# Altium schematic sheet STM32.SchDoc
size D; SheetNumber: 8; SheetTotal: 8
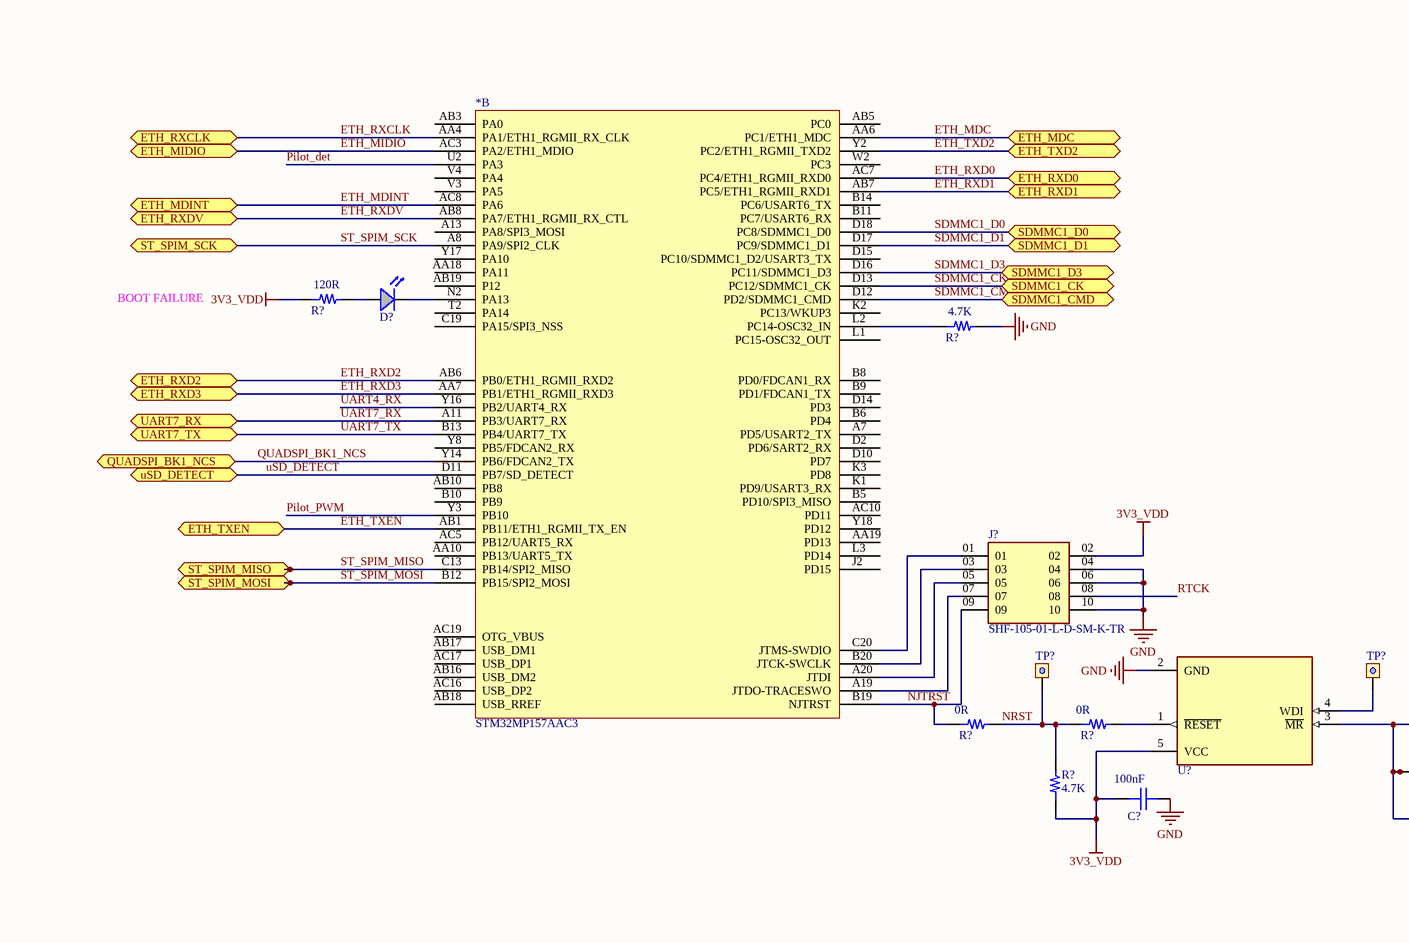
[diagram p0: STM32.SchDoc, top left]
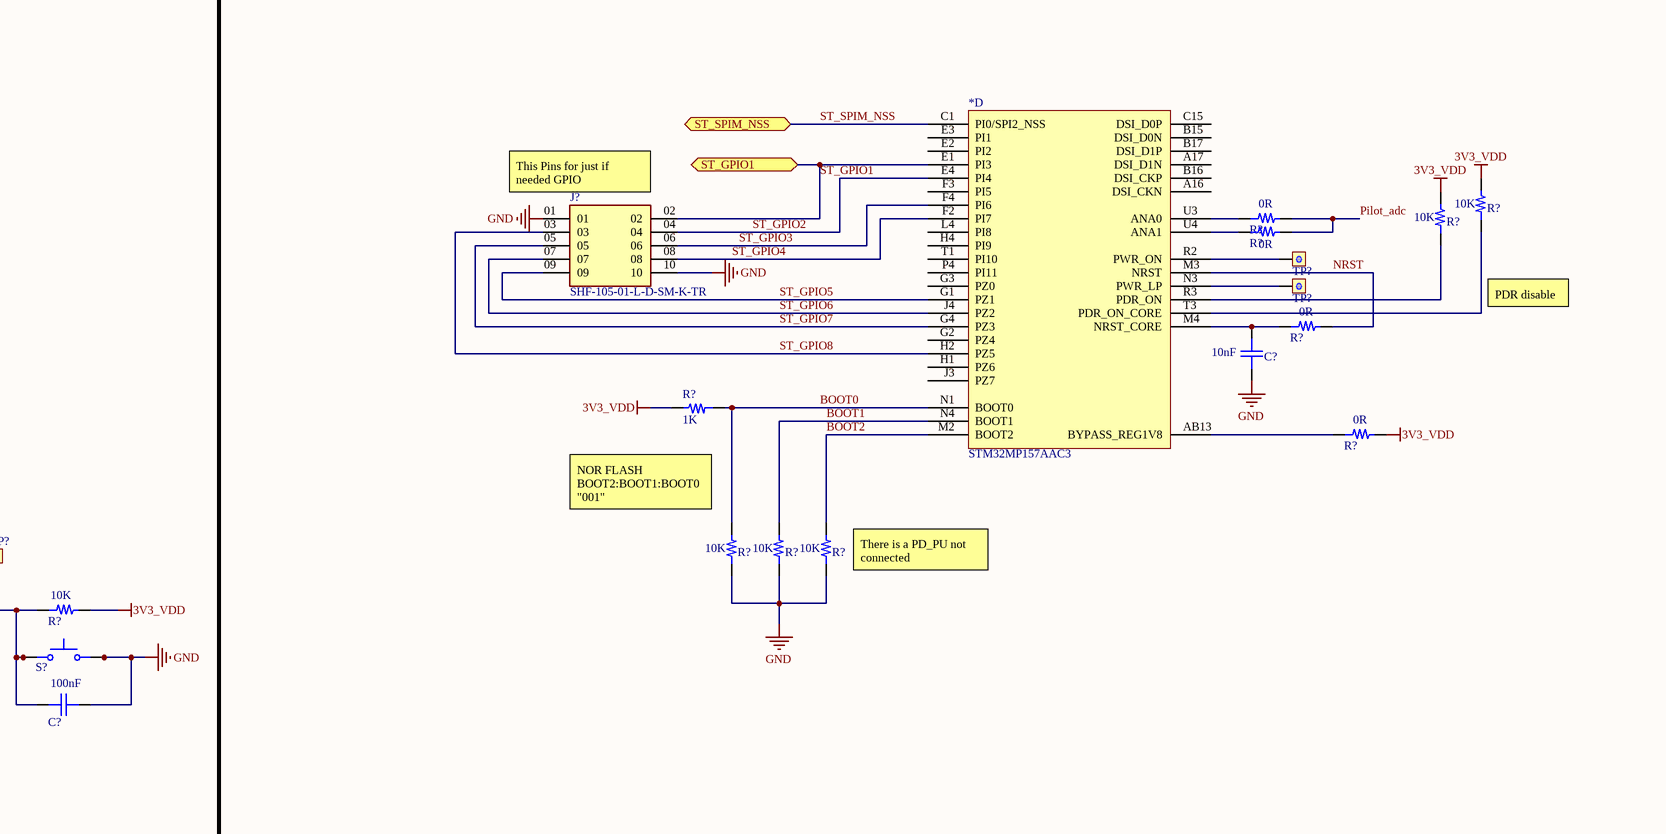
[diagram p1: STM32.SchDoc, top middle]
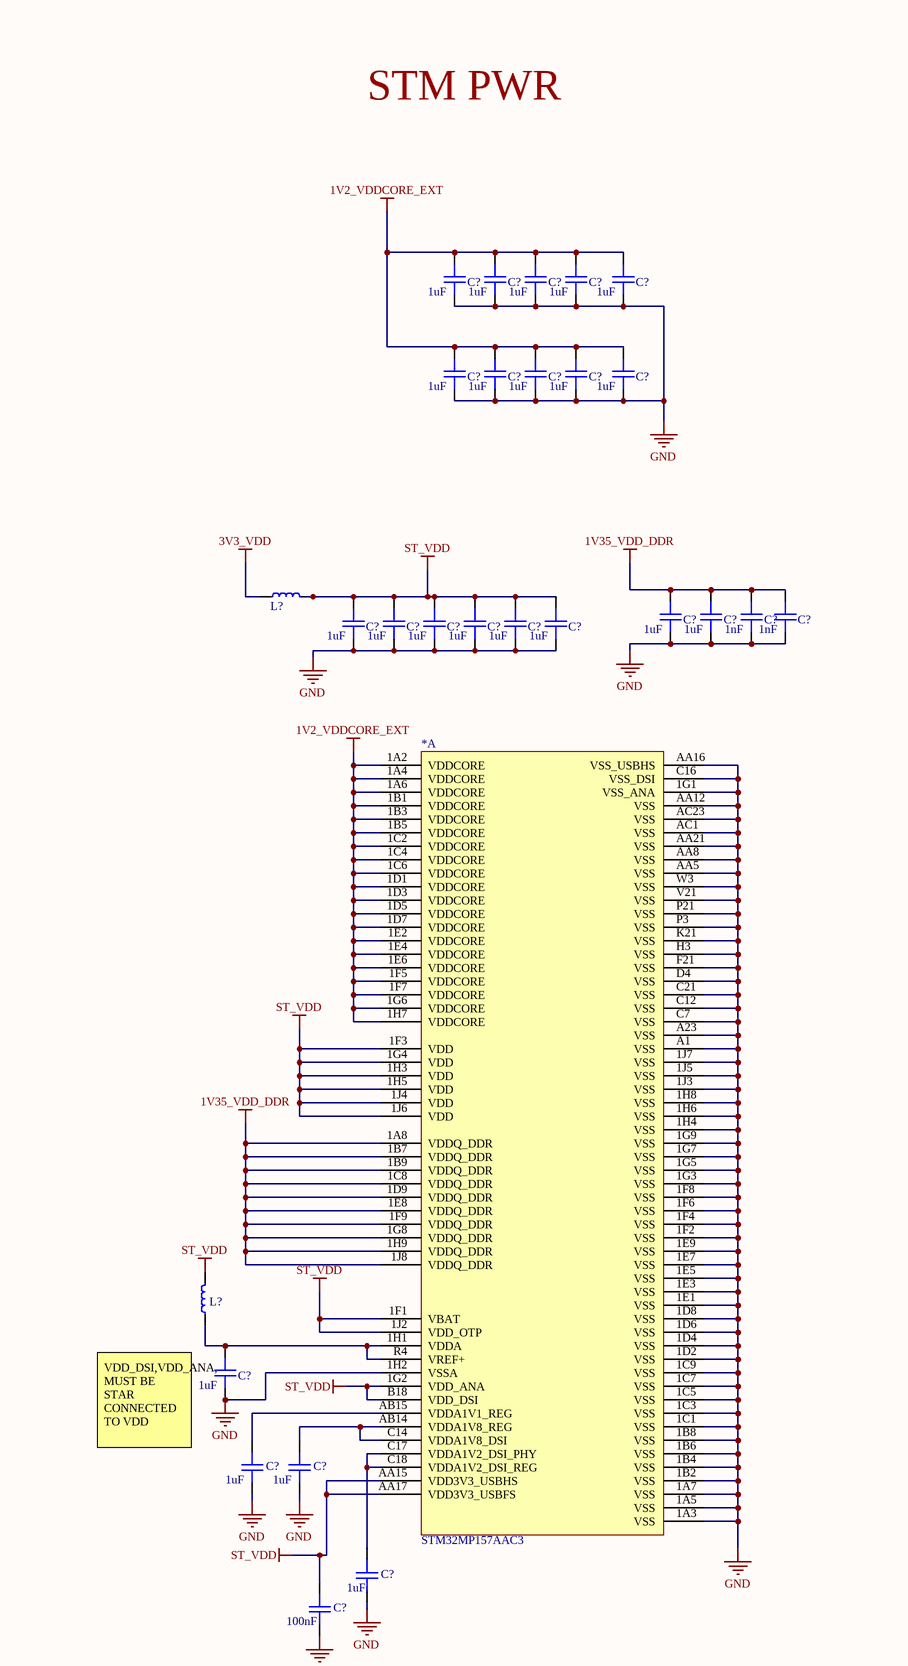
[diagram p2: STM32.SchDoc, top right]
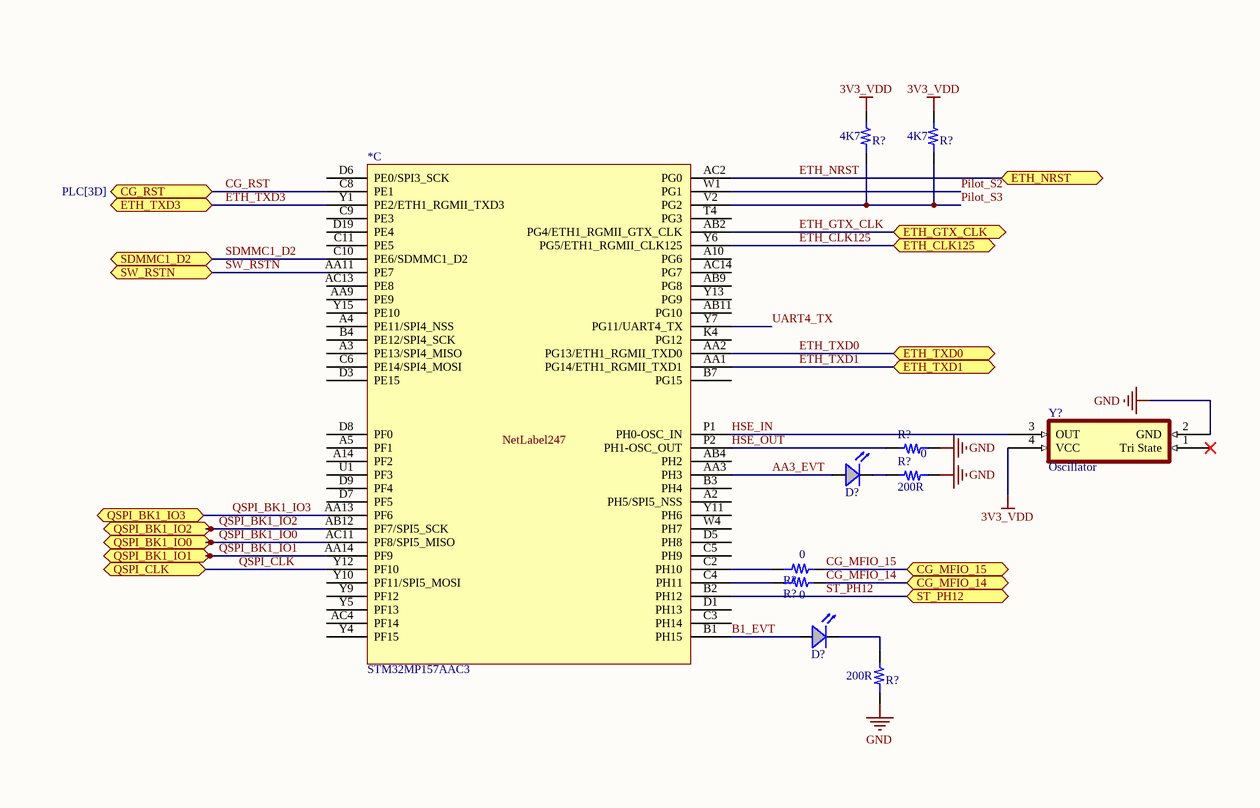
[diagram p3: STM32.SchDoc, bottom left]
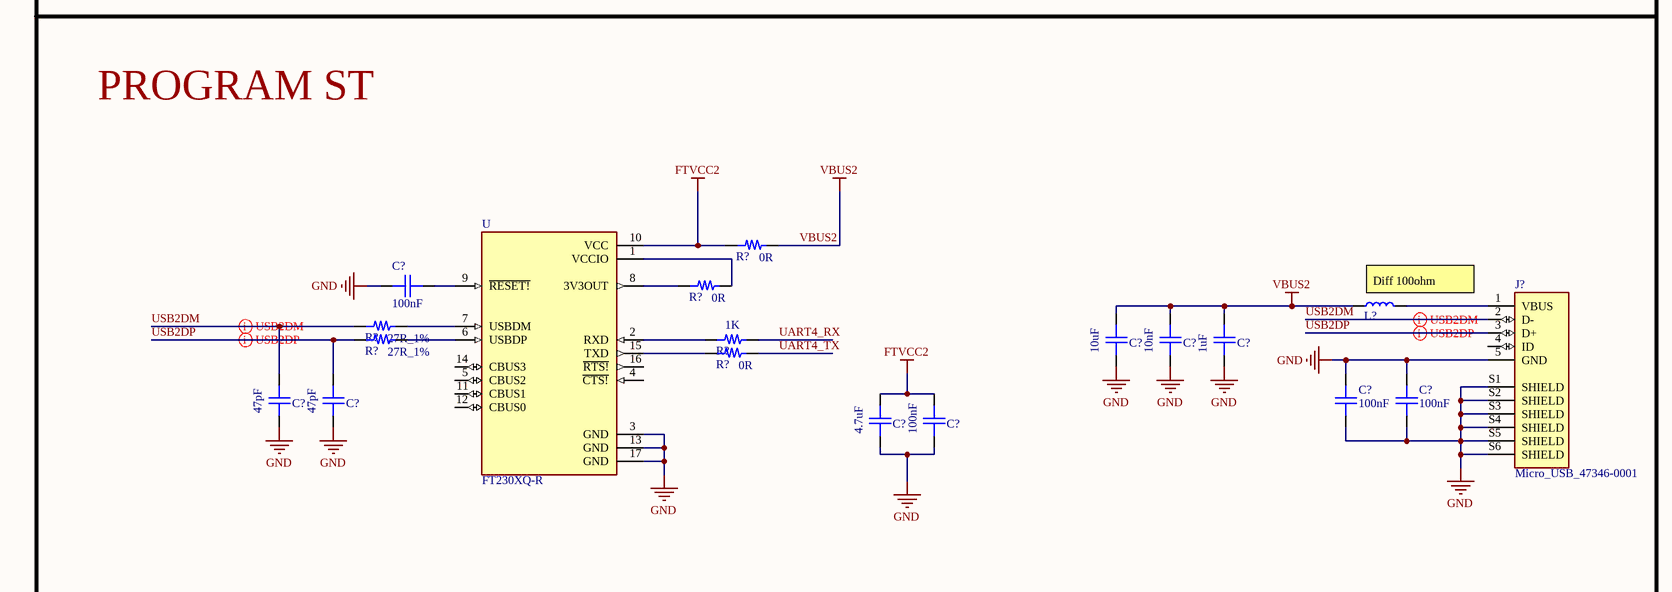
[diagram p4: STM32.SchDoc, bottom middle]
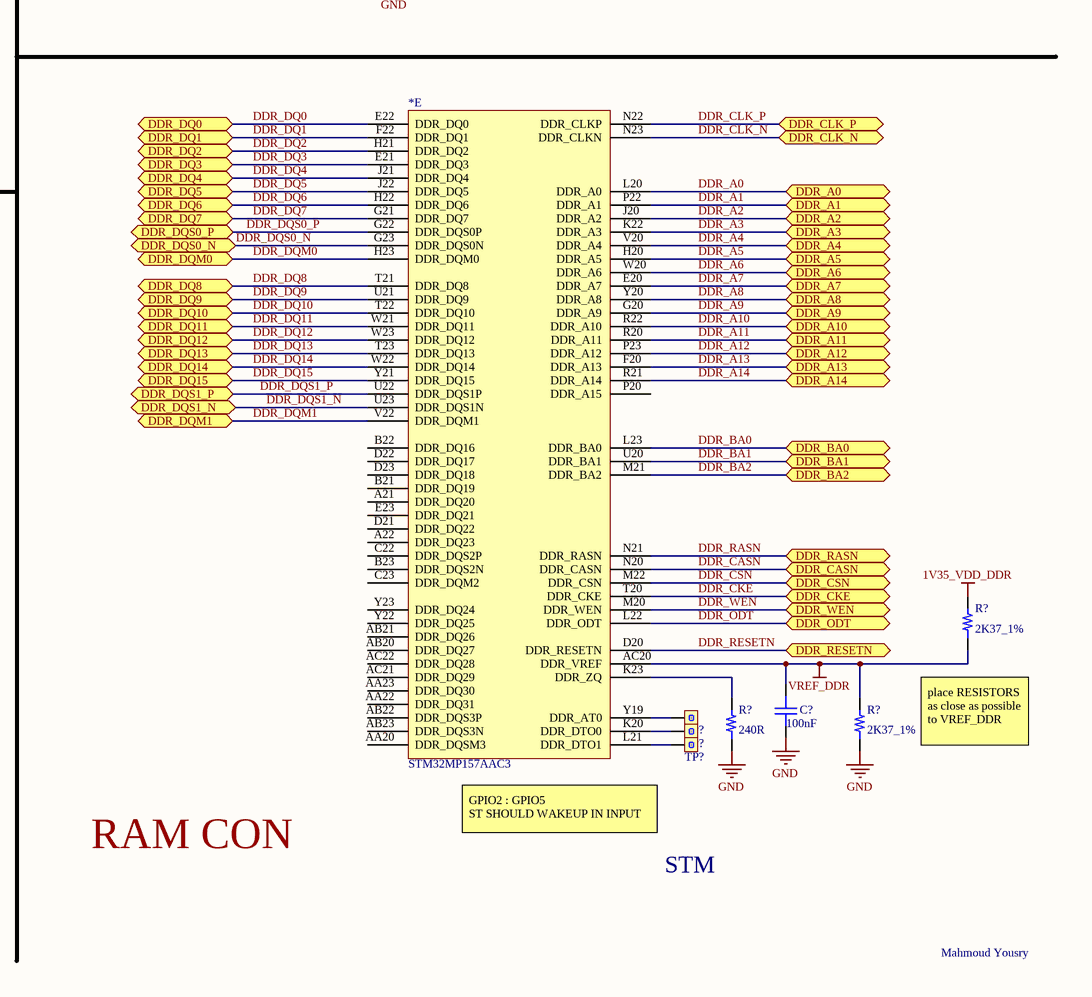
[diagram p5: STM32.SchDoc, bottom right]

## Parts
(Parts that share a designator on the sheet are numbered #1, #2 ... from top to bottom, then left to right.)
*#1  STM32MP157AAC3  (part B of 5)
*#2  STM32MP157AAC3  (part D of 5)
*#3  STM32MP157AAC3  (part A of 5)
*#4  STM32MP157AAC3  (part C of 5)
*#5  STM32MP157AAC3  (part E of 5)
C?#1  value 1uF  [C0402]  (hidden comment: Capacitor)
C?#2  value 1uF  [C0402]  (hidden comment: Capacitor)
C?#3  value 1uF  [C0402]  (hidden comment: Capacitor)
C?#4  value 1uF  [C0402]  (hidden comment: Capacitor)
C?#5  value 1uF  [C0402]  (hidden comment: Capacitor)
C?#6  value 1uF  [C0402]  (hidden comment: Capacitor)
C?#7  value 1uF  [C0402]  (hidden comment: Capacitor)
C?#8  value 1uF  [C0402]  (hidden comment: Capacitor)
C?#9  value 1uF  [C0402]  (hidden comment: Capacitor)
C?#10  value 1uF  [C0402]  (hidden comment: Capacitor)
C?#11  value 1uF  [C0402]  (hidden comment: Capacitor)
C?#12  value 1uF  [C0402]  (hidden comment: Capacitor)
C?#13  value 1nF  [C0402]  (hidden comment: Capacitor)
C?#14  value 1nF  [C0402]  (hidden comment: Capacitor)
C?#15  value 1uF  [C0402]  (hidden comment: Capacitor)
C?#16  value 1uF  [C0402]  (hidden comment: Capacitor)
C?#17  value 1uF  [C0402]  (hidden comment: Capacitor)
C?#18  value 1uF  [C0402]  (hidden comment: Capacitor)
C?#19  value 1uF  [C0402]  (hidden comment: Capacitor)
C?#20  value 1uF  [C0402]  (hidden comment: Capacitor)
C?#21  value 10nF  [C0402]  (hidden comment: Capacitor)
C?#22  value 100nF  [C0402]  (hidden comment: Capacitor)
C?#23  value 100nF  [C0402]  (hidden comment: Capacitor)
C?#24  value 1uF  [C0402]  (hidden comment: Capacitor)
C?#25  value 1uF  [C0402]  (hidden comment: Capacitor)
C?#26  value 1uF  [C0402]  (hidden comment: Capacitor)
C?#27  value 1uF  [C0402]  (hidden comment: Capacitor)
C?#28  value 100nF  [C0402]  (hidden comment: Capacitor)
C?#29  value 100nF  [C0402]  (hidden comment: Capacitor)
C?#30  value 10uF  [C0402]  (hidden comment: Capacitor)
C?#31  value 10nF  [C0402]  (hidden comment: Capacitor)
C?#32  value 1uF  [C0402]  (hidden comment: Capacitor)
C?#33  value 47pF  [C0402]  (hidden comment: Capacitor)
C?#34  value 47pF  [C0402]  (hidden comment: Capacitor)
C?#35  value 100nF  [C0402]  (hidden comment: Capacitor)
C?#36  value 100nF  [C0402]  (hidden comment: Capacitor)
C?#37  value 4.7uF  [C0402]  (hidden comment: Capacitor)
C?#38  value 100nF  [C0402]  (hidden comment: Capacitor)
C?#39  value 100nF  [C0402]  (hidden comment: Capacitor)
D?#1  LED  [LED_0603]  (value not drawn)
D?#2  LED  [LED_0603]  (value not drawn)
D?#3  LED  [LED_0603]  (value not drawn)
J?#1  SHF-105-01-L-D-SM-K-TR  [SAMTEC_SHF-105-01-L-D-SM-K-TR]
J?#2  SHF-105-01-L-D-SM-K-TR  [SAMTEC_SHF-105-01-L-D-SM-K-TR]
J?#3  Micro_USB_47346-0001  [Micro_USB_47346-0001]
L?#1  Inductor  [L_0603]  (value not drawn)
L?#2  Inductor  [L_0603]  (value not drawn)
L?#3  Inductor  [L_0603]  (value not drawn)
R?#1  value 120R  [R0402]  (hidden comment: Resistor)
R?#2  value 4.7K  [R0402]  (hidden comment: Resistor)
R?#3  value 0R  [R0402]  (hidden comment: Resistor)
R?#4  value 0R  [R0402]  (hidden comment: Resistor)
R?#5  value 10K  [R0402]  (hidden comment: Resistor)
R?#6  value 10K  [R0402]  (hidden comment: Resistor)
R?#7  value 0R  [R0402]  (hidden comment: Resistor)
R?#8  value 1K  [R0402]  (hidden comment: Resistor)
R?#9  value 0R  [R0402]  (hidden comment: Resistor)
R?#10  value 10K  [R0402]  (hidden comment: Resistor)
R?#11  value 10K  [R0402]  (hidden comment: Resistor)
R?#12  value 10K  [R0402]  (hidden comment: Resistor)
R?#13  value 0R  [R0402]  (hidden comment: Resistor)
R?#14  value 0R  [R0402]  (hidden comment: Resistor)
R?#15  value 10K  [R0402]  (hidden comment: Resistor)
R?#16  value 4.7K  [R0402]  (hidden comment: Resistor)
R?#17  value 4K7  [R0402]  (hidden comment: Resistor)
R?#18  value 4K7  [R0402]  (hidden comment: Resistor)
R?#19  value 0  [R0402]  (hidden comment: Resistor)
R?#20  value 200R  [R0402]  (hidden comment: Resistor)
R?#21  value 0  [R0402]  (hidden comment: Resistor)
R?#22  value 0R  [R0402]  (hidden comment: Resistor)
R?#23  value 0  [R0402]  (hidden comment: Resistor)
R?#24  value 0R  [R0402]  (hidden comment: Resistor)
R?#25  value 27R_1%  [R0402]  (hidden comment: Resistor)
R?#26  value 27R_1%  [R0402]  (hidden comment: Resistor)
R?#27  value 1K  [R0402]  (hidden comment: Resistor)
R?#28  value 0R  [R0402]  (hidden comment: Resistor)
R?#29  value 200R  [R0402]  (hidden comment: Resistor)
R?#30  value 2K37_1%  [R0402]  (hidden comment: Resistor)
R?#31  value 240R  [R0402]  (hidden comment: Resistor)
R?#32  value 2K37_1%  [R0402]  (hidden comment: Resistor)
S?  Push Button 4 pin  [Push_Button(6x6mm)]  (value not drawn)
TP?#1  Test Point  [Test Point]  (value not drawn)
TP?#2  Test Point  [Test Point]  (value not drawn)
TP?#3  Test Point  [Test Point]  (value not drawn)
TP?#4  Test Point  [Test Point]  (value not drawn)
TP?#5  Test Point  [Test Point]  (value not drawn)
TP?#6  Test Point  [Test Point]  (value not drawn)
TP?#7  Test Point  [Test Point]  (value not drawn)
U  FT230XQ-R  [FT230XQ-R]
U?  Supervisory Circuits  [SOT-23-5]  (value not drawn)
Y?  Oscillator  [ECS-3225Q-33-240-BS-TR]

## Ports
CG_MFIO_14 (bidir), CG_MFIO_15 (bidir), CG_RST (bidir, see PLC[3D]), DDR_A0 (bidir), DDR_A1 (bidir), DDR_A2 (bidir), DDR_A3 (bidir), DDR_A4 (bidir), DDR_A5 (bidir), DDR_A6 (bidir), DDR_A7 (bidir), DDR_A8 (bidir), DDR_A9 (bidir), DDR_A10 (bidir), DDR_A11 (bidir), DDR_A12 (bidir), DDR_A13 (bidir), DDR_A14 (bidir), DDR_BA0 (bidir), DDR_BA1 (bidir), DDR_BA2 (bidir), DDR_CASN (bidir), DDR_CKE (bidir), DDR_CLK_N (bidir), DDR_CLK_P (bidir), DDR_CSN (bidir), DDR_DQ0 (bidir), DDR_DQ1 (bidir), DDR_DQ2 (bidir), DDR_DQ3 (bidir), DDR_DQ4 (bidir), DDR_DQ5 (bidir), DDR_DQ6 (bidir), DDR_DQ7 (bidir), DDR_DQ8 (bidir), DDR_DQ9 (bidir), DDR_DQ10 (bidir), DDR_DQ11 (bidir), DDR_DQ12 (bidir), DDR_DQ13 (bidir), DDR_DQ14 (bidir), DDR_DQ15 (bidir), DDR_DQM0 (bidir), DDR_DQM1 (bidir), DDR_DQS0_N (bidir), DDR_DQS0_P (bidir), DDR_DQS1_N (bidir), DDR_DQS1_P (bidir), DDR_ODT (bidir), DDR_RASN (bidir), DDR_RESETN (bidir), DDR_WEN (bidir), ETH_CLK125 (bidir), ETH_GTX_CLK (bidir), ETH_MDC (bidir), ETH_MDINT (bidir), ETH_MIDIO (bidir), ETH_NRST (bidir), ETH_RXCLK (bidir), ETH_RXD0 (bidir), ETH_RXD1 (bidir), ETH_RXD2 (bidir), ETH_RXD3 (bidir), ETH_RXDV (bidir), ETH_TXD0 (bidir), ETH_TXD1 (bidir), ETH_TXD2 (bidir), ETH_TXD3 (bidir), ETH_TXEN (bidir), QSPI_BK1_IO0 (bidir), QSPI_BK1_IO1 (bidir), QSPI_BK1_IO2 (bidir), QSPI_BK1_IO3 (bidir), QSPI_CLK (bidir), QUADSPI_BK1_NCS (bidir), SDMMC1_CK (bidir), SDMMC1_CMD (bidir), SDMMC1_D0 (bidir), SDMMC1_D1 (bidir), SDMMC1_D2 (bidir), SDMMC1_D3 (bidir), ST_GPIO1 (bidir), ST_PH12 (bidir), ST_SPIM_MISO (bidir), ST_SPIM_MOSI (bidir), ST_SPIM_NSS (bidir), ST_SPIM_SCK (bidir), SW_RSTN (bidir), UART7_RX (bidir), UART7_TX (bidir), uSD_DETECT (bidir)

## Nets
1V2_VDDCORE_EXT: *#3.1A2(VDDCORE) *#3.1A4(VDDCORE) *#3.1A6(VDDCORE) *#3.1B1(VDDCORE) *#3.1B3(VDDCORE) *#3.1B5(VDDCORE) *#3.1C2(VDDCORE) *#3.1C4(VDDCORE) *#3.1C6(VDDCORE) *#3.1D1(VDDCORE) *#3.1D3(VDDCORE) *#3.1D5(VDDCORE) *#3.1D7(VDDCORE) *#3.1E2(VDDCORE) *#3.1E4(VDDCORE) *#3.1E6(VDDCORE) *#3.1F5(VDDCORE) *#3.1F7(VDDCORE) *#3.1G6(VDDCORE) *#3.1H7(VDDCORE) C?#1.1 C?#2.1 C?#3.1 C?#4.1 C?#5.1 C?#6.1 C?#7.1 C?#8.1 C?#9.1 C?#10.1
1V35_VDD_DDR: *#3.1A8(VDDQ_DDR) *#3.1B7(VDDQ_DDR) *#3.1B9(VDDQ_DDR) *#3.1C8(VDDQ_DDR) *#3.1D9(VDDQ_DDR) *#3.1E8(VDDQ_DDR) *#3.1F9(VDDQ_DDR) *#3.1G8(VDDQ_DDR) *#3.1H9(VDDQ_DDR) *#3.1J8(VDDQ_DDR) C?#11.1 C?#12.1 C?#13.1 C?#14.1 R?#30.1
3V3_VDD: C?#22.1 J?#2.02 L?#1.1 R?#1.1 R?#5.1 R?#6.1 R?#8.1 R?#9.1 R?#15.1 R?#16.1 R?#17.1 R?#18.1 U?.5(VCC) Y?.4(VCC)
FTVCC2: C?#37.1 C?#38.1 R?#22.1 U.10(VCC)
GND: *#3.1A3(VSS) *#3.1A5(VSS) *#3.1A7(VSS) *#3.1B2(VSS) *#3.1B4(VSS) *#3.1B6(VSS) *#3.1B8(VSS) *#3.1C1(VSS) *#3.1C3(VSS) *#3.1C5(VSS) *#3.1C7(VSS) *#3.1C9(VSS) *#3.1D2(VSS) *#3.1D4(VSS) *#3.1D6(VSS) *#3.1D8(VSS) *#3.1E1(VSS) *#3.1E3(VSS) *#3.1E5(VSS) *#3.1E7(VSS) *#3.1E9(VSS) *#3.1F2(VSS) *#3.1F4(VSS) *#3.1F6(VSS) *#3.1F8(VSS) *#3.1G1(VSS_ANA) *#3.1G3(VSS) *#3.1G5(VSS) *#3.1G7(VSS) *#3.1G9(VSS) *#3.1H2(VSSA) *#3.1H4(VSS) *#3.1H6(VSS) *#3.1H8(VSS) *#3.1J3(VSS) *#3.1J5(VSS) *#3.1J7(VSS) *#3.A1(VSS) *#3.A23(VSS) *#3.AA5(VSS) *#3.AA8(VSS) *#3.AA12(VSS) *#3.AA16(VSS_USBHS) *#3.AA21(VSS) *#3.AC1(VSS) *#3.AC23(VSS) *#3.C7(VSS) *#3.C12(VSS) *#3.C16(VSS_DSI) *#3.C21(VSS) *#3.D4(VSS) *#3.F21(VSS) *#3.H3(VSS) *#3.K21(VSS) *#3.P3(VSS) *#3.P21(VSS) *#3.V21(VSS) *#3.W3(VSS) C?#1.1 C?#2.1 C?#3.1 C?#4.1 C?#5.1 C?#6.1 C?#7.1 C?#8.1 C?#9.1 C?#10.1 C?#11.1 C?#12.1 C?#13.1 C?#14.1 C?#15.1 C?#16.1 C?#17.1 C?#18.1 C?#19.1 C?#20.1 C?#21.1 C?#22.1 C?#23.1 C?#24.1 C?#25.1 C?#26.1 C?#27.1 C?#28.1 C?#29.1 C?#30.1 C?#31.1 C?#32.1 C?#33.1 C?#34.1 C?#35.1 C?#36.1 C?#37.1 C?#38.1 C?#39.1 J?#1.01 J?#1.10 J?#2.04 J?#2.06 J?#2.10 J?#3.5(GND) J?#3.S1(SHIELD) J?#3.S2(SHIELD) J?#3.S3(SHIELD) J?#3.S4(SHIELD) J?#3.S5(SHIELD) J?#3.S6(SHIELD) R?#2.1 R?#10.1 R?#11.1 R?#12.1 R?#19.1 R?#20.1 R?#29.1 R?#31.1 R?#32.1 S?.3 S?.4 U.3(GND) U.13(GND) U.17(GND) U?.2(GND) Y?.2(GND)
ST_VDD: *#3.1F1(VBAT) *#3.1F3(VDD) *#3.1G2(VDD_ANA) *#3.1G4(VDD) *#3.1H3(VDD) *#3.1H5(VDD) *#3.1J2(VDD_OTP) *#3.1J4(VDD) *#3.1J6(VDD) *#3.AA15(VDD3V3_USBHS) *#3.AA17(VDD3V3_USBFS) *#3.B18(VDD_DSI) C?#15.1 C?#16.1 C?#17.1 C?#18.1 C?#19.1 C?#20.1 C?#28.1 L?#1.2 L?#2.2
VBUS2: C?#30.1 C?#31.1 C?#32.1 L?#3.1 R?#22.1
VREF_DDR: *#5.AC20(DDR_VREF) C?#39.1 R?#30.1 R?#32.1
AA3_EVT: *#4.AA3(PH3) D?#2.A
B1_EVT: *#4.B1(PH15) D?#3.A
BOOT0: *#2.N1(BOOT0) R?#8.1 R?#10.1
BOOT1: *#2.N4(BOOT1) R?#11.1
BOOT2: *#2.M2(BOOT2) R?#12.1
CG_MFIO_14: R?#23.1 ; port CG_MFIO_14
CG_MFIO_15: R?#21.1 ; port CG_MFIO_15
CG_RST: *#4.C8(PE1) ; port CG_RST
DDR_A0: *#5.L20(DDR_A0) ; port DDR_A0
DDR_A1: *#5.P22(DDR_A1) ; port DDR_A1
DDR_A2: *#5.J20(DDR_A2) ; port DDR_A2
DDR_A3: *#5.K22(DDR_A3) ; port DDR_A3
DDR_A4: *#5.V20(DDR_A4) ; port DDR_A4
DDR_A5: *#5.H20(DDR_A5) ; port DDR_A5
DDR_A6: *#5.W20(DDR_A6) ; port DDR_A6
DDR_A7: *#5.E20(DDR_A7) ; port DDR_A7
DDR_A8: *#5.Y20(DDR_A8) ; port DDR_A8
DDR_A9: *#5.G20(DDR_A9) ; port DDR_A9
DDR_A10: *#5.R22(DDR_A10) ; port DDR_A10
DDR_A11: *#5.R20(DDR_A11) ; port DDR_A11
DDR_A12: *#5.P23(DDR_A12) ; port DDR_A12
DDR_A13: *#5.F20(DDR_A13) ; port DDR_A13
DDR_A14: *#5.R21(DDR_A14) ; port DDR_A14
DDR_BA0: *#5.L23(DDR_BA0) ; port DDR_BA0
DDR_BA1: *#5.U20(DDR_BA1) ; port DDR_BA1
DDR_BA2: *#5.M21(DDR_BA2) ; port DDR_BA2
DDR_CASN: *#5.N20(DDR_CASN) ; port DDR_CASN
DDR_CKE: *#5.T20(DDR_CKE) ; port DDR_CKE
DDR_CLK_N: *#5.N23(DDR_CLKN) ; port DDR_CLK_N
DDR_CLK_P: *#5.N22(DDR_CLKP) ; port DDR_CLK_P
DDR_CSN: *#5.M22(DDR_CSN) ; port DDR_CSN
DDR_DQ0: *#5.E22(DDR_DQ0) ; port DDR_DQ0
DDR_DQ1: *#5.F22(DDR_DQ1) ; port DDR_DQ1
DDR_DQ2: *#5.H21(DDR_DQ2) ; port DDR_DQ2
DDR_DQ3: *#5.E21(DDR_DQ3) ; port DDR_DQ3
DDR_DQ4: *#5.J21(DDR_DQ4) ; port DDR_DQ4
DDR_DQ5: *#5.J22(DDR_DQ5) ; port DDR_DQ5
DDR_DQ6: *#5.H22(DDR_DQ6) ; port DDR_DQ6
DDR_DQ7: *#5.G21(DDR_DQ7) ; port DDR_DQ7
DDR_DQ8: *#5.T21(DDR_DQ8) ; port DDR_DQ8
DDR_DQ9: *#5.U21(DDR_DQ9) ; port DDR_DQ9
DDR_DQ10: *#5.T22(DDR_DQ10) ; port DDR_DQ10
DDR_DQ11: *#5.W21(DDR_DQ11) ; port DDR_DQ11
DDR_DQ12: *#5.W23(DDR_DQ12) ; port DDR_DQ12
DDR_DQ13: *#5.T23(DDR_DQ13) ; port DDR_DQ13
DDR_DQ14: *#5.W22(DDR_DQ14) ; port DDR_DQ14
DDR_DQ15: *#5.Y21(DDR_DQ15) ; port DDR_DQ15
DDR_DQM0: *#5.H23(DDR_DQM0) ; port DDR_DQM0
DDR_DQM1: *#5.V22(DDR_DQM1) ; port DDR_DQM1
DDR_DQS0_N: *#5.G23(DDR_DQS0N) ; port DDR_DQS0_N
DDR_DQS0_P: *#5.G22(DDR_DQS0P) ; port DDR_DQS0_P
DDR_DQS1_N: *#5.U23(DDR_DQS1N) ; port DDR_DQS1_N
DDR_DQS1_P: *#5.U22(DDR_DQS1P) ; port DDR_DQS1_P
DDR_ODT: *#5.L22(DDR_ODT) ; port DDR_ODT
DDR_RASN: *#5.N21(DDR_RASN) ; port DDR_RASN
DDR_RESETN: *#5.D20(DDR_RESETN) ; port DDR_RESETN
DDR_WEN: *#5.M20(DDR_WEN) ; port DDR_WEN
ETH_CLK125: *#4.Y6(PG5/ETH1_RGMII_CLK125) ; port ETH_CLK125
ETH_GTX_CLK: *#4.AB2(PG4/ETH1_RGMII_GTX_CLK) ; port ETH_GTX_CLK
ETH_MDC: *#1.AA6(PC1/ETH1_MDC) ; port ETH_MDC
ETH_MDINT: *#1.AC8(PA6) ; port ETH_MDINT
ETH_MIDIO: *#1.AC3(PA2/ETH1_MDIO) ; port ETH_MIDIO
ETH_NRST: *#4.AC2(PG0) ; port ETH_NRST
ETH_RXCLK: *#1.AA4(PA1/ETH1_RGMII_RX_CLK) ; port ETH_RXCLK
ETH_RXD0: *#1.AC7(PC4/ETH1_RGMII_RXD0) ; port ETH_RXD0
ETH_RXD1: *#1.AB7(PC5/ETH1_RGMII_RXD1) ; port ETH_RXD1
ETH_RXD2: *#1.AB6(PB0/ETH1_RGMII_RXD2) ; port ETH_RXD2
ETH_RXD3: *#1.AA7(PB1/ETH1_RGMII_RXD3) ; port ETH_RXD3
ETH_RXDV: *#1.AB8(PA7/ETH1_RGMII_RX_CTL) ; port ETH_RXDV
ETH_TXD0: *#4.AA2(PG13/ETH1_RGMII_TXD0) ; port ETH_TXD0
ETH_TXD1: *#4.AA1(PG14/ETH1_RGMII_TXD1) ; port ETH_TXD1
ETH_TXD2: *#1.Y2(PC2/ETH1_RGMII_TXD2) ; port ETH_TXD2
ETH_TXD3: *#4.Y1(PE2/ETH1_RGMII_TXD3) ; port ETH_TXD3
ETH_TXEN: *#1.AB1(PB11/ETH1_RGMII_TX_EN) ; port ETH_TXEN
HSE_IN: *#4.P1(PH0-OSC_IN) Y?.3(OUT)
HSE_OUT: *#4.P2(PH1-OSC_OUT) R?#19.1
NJTRST: *#1.B19(NJTRST) J?#2.09 R?#13.1
NRST: *#2.M3(NRST) R?#7.1 R?#13.1 R?#14.1 R?#16.1 TP?#3.0
Pilot_adc: R?#3.1 R?#4.1
Pilot_det: *#1.U2(PA3)
Pilot_PWM: *#1.Y3(PB10)
Pilot_S2: *#4.W1(PG1)
Pilot_S3: *#4.V2(PG2) R?#17.1 R?#18.1
QSPI_BK1_IO0: *#4.AC11(PF8/SPI5_MISO) ; port QSPI_BK1_IO0
QSPI_BK1_IO1: *#4.AA14(PF9) ; port QSPI_BK1_IO1
QSPI_BK1_IO2: *#4.AB12(PF7/SPI5_SCK) ; port QSPI_BK1_IO2
QSPI_BK1_IO3: *#4.AA13(PF6) ; port QSPI_BK1_IO3
QSPI_CLK: *#4.Y12(PF10) ; port QSPI_CLK
QUADSPI_BK1_NCS: *#1.Y14(PB6/FDCAN2_TX) ; port QUADSPI_BK1_NCS
RTCK: J?#2.08
SDMMC1_CK: *#1.D13(PC12/SDMMC1_CK) ; port SDMMC1_CK
SDMMC1_CMD: *#1.D12(PD2/SDMMC1_CMD) ; port SDMMC1_CMD
SDMMC1_D0: *#1.D18(PC8/SDMMC1_D0) ; port SDMMC1_D0
SDMMC1_D1: *#1.D17(PC9/SDMMC1_D1) ; port SDMMC1_D1
SDMMC1_D2: *#4.C10(PE6/SDMMC1_D2) ; port SDMMC1_D2
SDMMC1_D3: *#1.D16(PC11/SDMMC1_D3) ; port SDMMC1_D3
ST_GPIO1: *#2.E1(PI3) J?#1.02 ; port ST_GPIO1
ST_GPIO2: *#2.E4(PI4) J?#1.04
ST_GPIO3: *#2.F4(PI6) J?#1.06
ST_GPIO4: *#2.F2(PI7) J?#1.08
ST_GPIO5: *#2.G1(PZ1) J?#1.09
ST_GPIO6: *#2.J4(PZ2) J?#1.07
ST_GPIO7: *#2.G4(PZ3) J?#1.05
ST_GPIO8: *#2.H2(PZ5) J?#1.03
ST_PH12: *#4.B2(PH12) ; port ST_PH12
ST_SPIM_MISO: *#1.C13(PB14/SPI2_MISO) ; port ST_SPIM_MISO
ST_SPIM_MOSI: *#1.B12(PB15/SPI2_MOSI) ; port ST_SPIM_MOSI
ST_SPIM_NSS: *#2.C1(PI0/SPI2_NSS) ; port ST_SPIM_NSS
ST_SPIM_SCK: *#1.A8(PA9/SPI2_CLK) ; port ST_SPIM_SCK
SW_RSTN: *#4.AA11(PE7) ; port SW_RSTN
UART4_RX: *#1.Y16(PB2/UART4_RX) R?#27.1
UART4_TX: *#4.Y7(PG11/UART4_TX) R?#28.1
UART7_RX: *#1.A11(PB3/UART7_RX) ; port UART7_RX
UART7_TX: *#1.B13(PB4/UART7_TX) ; port UART7_TX
USB2DM: C?#33.1 J?#3.2(D-) R?#25.1
USB2DP: C?#34.1 J?#3.3(D+) R?#26.1
uSD_DETECT: *#1.D11(PB7/SD_DETECT) ; port uSD_DETECT
Net*#1_A19: *#1.A19(JTDO-TRACESWO) J?#2.07
Net*#1_A20: *#1.A20(JTDI) J?#2.05
Net*#1_B20: *#1.B20(JTCK-SWCLK) J?#2.03
Net*#1_C20: *#1.C20(JTMS-SWDIO) J?#2.01
Net*#1_L2: *#1.L2(PC14-OSC32_IN) R?#2.1
Net*#1_N2: *#1.N2(PA13) D?#1.C(K)
Net*#2_AB13: *#2.AB13(BYPASS_REG1V8) R?#9.1
Net*#2_M4: *#2.M4(NRST_CORE) C?#21.1 R?#7.1
Net*#2_N3: *#2.N3(PWR_LP) TP?#2.0
Net*#2_R2: *#2.R2(PWR_ON) TP?#1.0
Net*#2_R3: *#2.R3(PDR_ON) R?#6.1
Net*#2_T3: *#2.T3(PDR_ON_CORE) R?#5.1
Net*#2_U3: *#2.U3(ANA0) R?#3.1
Net*#2_U4: *#2.U4(ANA1) R?#4.1
Net*#3_1H1: *#3.1H1(VDDA) *#3.R4(VREF+) C?#24.1 L?#2.1
Net*#3_AB14: *#3.AB14(VDDA1V8_REG) *#3.C14(VDDA1V8_DSI) C?#26.1
Net*#3_AB15: *#3.AB15(VDDA1V1_REG) C?#25.1
Net*#3_C17: *#3.C17(VDDA1V2_DSI_PHY) *#3.C18(VDDA1V2_DSI_REG) C?#27.1
Net*#4_C2: *#4.C2(PH10) R?#21.1
Net*#4_C4: *#4.C4(PH11) R?#23.1
Net*#5_K20: *#5.K20(DDR_DTO0) TP?#6.0
Net*#5_K23: *#5.K23(DDR_ZQ) R?#31.1
Net*#5_L21: *#5.L21(DDR_DTO1) TP?#7.0
Net*#5_Y19: *#5.Y19(DDR_AT0) TP?#5.0
NetC?#23_1: C?#23.1 R?#15.1 S?.1 S?.2 U?.3(~{MR})
NetC?#29_1: C?#29.1 U.9(~{RESET!})
NetD?#1_A: D?#1.A R?#1.1
NetD?#2_C: D?#2.C(K) R?#20.1
NetD?#3_C: D?#3.C(K) R?#29.1
NetJ?#3_1: J?#3.1(VBUS) L?#3.2
NetR?#14_1: R?#14.1 U?.1(~{RESET})
NetR?#24_1: R?#24.1 U.1(VCCIO)
NetR?#24_1: R?#24.1 U.8(3V3OUT)  [a separate net that carries the same name]
NetR?#25_1: R?#25.1 U.7(USBDM)
NetR?#26_1: R?#26.1 U.6(USBDP)
NetR?#27_1: R?#27.1 U.2(RXD)
NetR?#28_1: R?#28.1 U.15(TXD)
NetTP?#4_0: TP?#4.0 U?.4(WDI)

Not connected (* = marked no-connect by the designer): *#1 A7(PD5/USART2_TX) A13(PA8/SPI3_MOSI) AA10(PB13/UART5_TX) AA18(PA11) AA19(PD13) AB3(PA0) AB5(PC0) AB10(PB8) AB16(USB_DM2) AB17(USB_DM1) AB18(USB_RREF) AB19(P12) AC5(PB12/UART5_RX) AC10(PD11) AC16(USB_DP2) AC17(USB_DP1) AC19(OTG_VBUS) B5(PD10/SPI3_MISO) B6(PD4) B8(PD0/FDCAN1_RX) B9(PD1/FDCAN1_TX) B10(PB9) B11(PC7/USART6_RX) B14(PC6/USART6_TX) C19(PA15/SPI3_NSS) D2(PD6/SART2_RX) D10(PD7) D14(PD3) D15(PC10/SDMMC1_D2/USART3_TX) J2(PD15) K1(PD9/USART3_RX) K2(PC13/WKUP3) K3(PD8) L1(PC15-OSC32_OUT) L3(PD14) T2(PA14) V3(PA5) V4(PA4) W2(PC3) Y8(PB5/FDCAN2_RX) Y17(PA10) Y18(PD12); *#2 A16(DSI_CKN) A17(DSI_D1N) B15(DSI_D0N) B16(DSI_CKP) B17(DSI_D1P) C15(DSI_D0P) E2(PI2) E3(PI1) F3(PI5) G2(PZ4) G3(PZ0) H1(PZ6) H4(PI9) J3(PZ7) L4(PI8) P4(PI11) T1(PI10); *#4 A2(PH5/SPI5_NSS) A3(PE13/SPI4_MISO) A4(PE11/SPI4_NSS) A5(PF1) A10(PG6) A14(PF2) AA9(PE9) AB4(PH2) AB9(PG8) AB11(PG10) AC4(PF14) AC13(PE8) AC14(PG7) B3(PH4) B4(PE12/SPI4_SCK) B7(PG15) C3(PH14) C5(PH9) C6(PE14/SPI4_MOSI) C9(PE3) C11(PE5) D1(PH13) D3(PE15) D5(PH8) D6(PE0/SPI3_SCK) D7(PF5) D8(PF0) D9(PF4) D19(PE4) K4(PG12) T4(PG3) U1(PF3) W4(PH7) Y4(PF15) Y5(PF13) Y9(PF12) Y10(PF11/SPI5_MOSI) Y11(PH6) Y13(PG9) Y15(PE10); *#5 A21(DDR_DQ20) A22(DDR_DQ23) AA20(DDR_DQSM3) AA22(DDR_DQ31) AA23(DDR_DQ30) AB20(DDR_DQ27) AB21(DDR_DQ26) AB22(DDR_DQS3P) AB23(DDR_DQS3N) AC21(DDR_DQ29) AC22(DDR_DQ28) B21(DDR_DQ19) B22(DDR_DQ16) B23(DDR_DQS2N) C22(DDR_DQS2P) C23(DDR_DQM2) D21(DDR_DQ22) D22(DDR_DQ17) D23(DDR_DQ18) E23(DDR_DQ21) P20(DDR_A15) Y22(DDR_DQ25) Y23(DDR_DQ24); J?#3 4(ID); U 4(~{CTS!}) 5(CBUS2) 11(CBUS1) 12(CBUS0) 14(CBUS3) 16(~{RTS!}); Y? 1(Tri_State)*

## Layout directives
differential pair; net class STM_USB: USB2DM, USB2DP

## Notes on the sheet
- STM PWR
- BOOT FAILURE
- (near J?#1) This Pins for just if needed GPIO
- PDR disable
- (near R?#10) NOR FLASH
  BOOT2:BOOT1:BOOT0
  "001"
- (near R?#12) There is a PD_PU not connected
- VDD_DSI,VDD_ANA, MUST BE STAR CONNECTED TO VDD
- PROGRAM ST
- (near L?#3) Diff 100ohm
- (near R?#30) place RESISTORS as close as possible to VREF_DDR
- RAM CON
- GPIO2 : GPIO5
  ST SHOULD WAKEUP IN INPUT
- STM
- Mahmoud Yousry
- Labels drawn without touching a wire or pin: NetLabel247

## Library data of the parts
C?#1-C?#39 = CAP_SMT: ComponentLink1Description: New link
J?#1 J?#2 = SHF-105-01-L-D-SM-K-TR: SMD Wire To Board Connector ROHS; MF: Samtec; Price: None; Package: None; MP: SHF-105-01-L-D-SM-K-TR; Availability: Unavailable; Value: *
J?#3 = Micro_USB_47346-0001: Conn Data USB Micro B w/Flange SMT Bottom Mnt LF | Molex Incorporated 47346-0001; SnapEDA_Link: https://www.snapeda.com/parts/47346-0001/Molex/view-part/?ref=snap; Package: None; Value: *; MF: Molex; MP: 47346-0001; Check_prices: https://www.snapeda.com/parts/47346-0001/Molex/view-part/?ref=eda
L?#1 L?#2 = Inductor_SMT: 120R_3A_0603; ComponentLink1Description: New link
L?#3 = Inductor_SMT: 600R_2A_1206; ComponentLink1Description: New link
R?#1 = RES_SMT: 180r_1%_0402; ComponentLink1Description: New link; ComponentLink1URL: *
R?#2 = RES_SMT: 4.7k; ComponentLink1Description: New link; ComponentLink1URL: *
R?#3-R?#32 = RES_SMT: ComponentLink1Description: New link; ComponentLink1URL: *
S? = Push_Button: Push Button SMD(6x6mm) 4 pin; ComponentLink1Description: New link
U = FT230XQ-R: USB Bridge, USB to UART USB 2.0 UART Interface 16-QFN (4x4); MF: FTDI,; Availability: Unavailable; Value: *; DigiKey-Purchase-URL: https://snapeda.com/shop?store=DigiKey&id=51347; Package: QFN-16 FTDI; Price: None; MP: FT230XQ-R; SnapEDA_Link: https://www.snapeda.com/parts/FT230XQ-R/FTDI,%20Future%20Technology%20Devices%20International%20Ltd/view-part/51347/?ref=snap
U? = MAX823: Supervisory Circuits 5-Pin Microprocessor Supervisory Circuit; ComponentLink1Description: New link; value: *
Y? = ECS ECS-3225Q-33-240-BS-TR: SMD3225-4P Crystal Oscillators ROHS / 24MHz
*#1-*#5 = STM32MP157AAC3: manufacturer: *; manufacturer_part_no: *; supplier: *; supplier_part_no: *; pkg: *; value: *; ComponentLink1Description: New link; ComponentLink1URL: *
D?#1-D?#3 = LED: ComponentLink1Description: New link; ComponentLink1URL: *; value: *